# Altium schematic sheet RGB LEDs.SchDoc
size A4
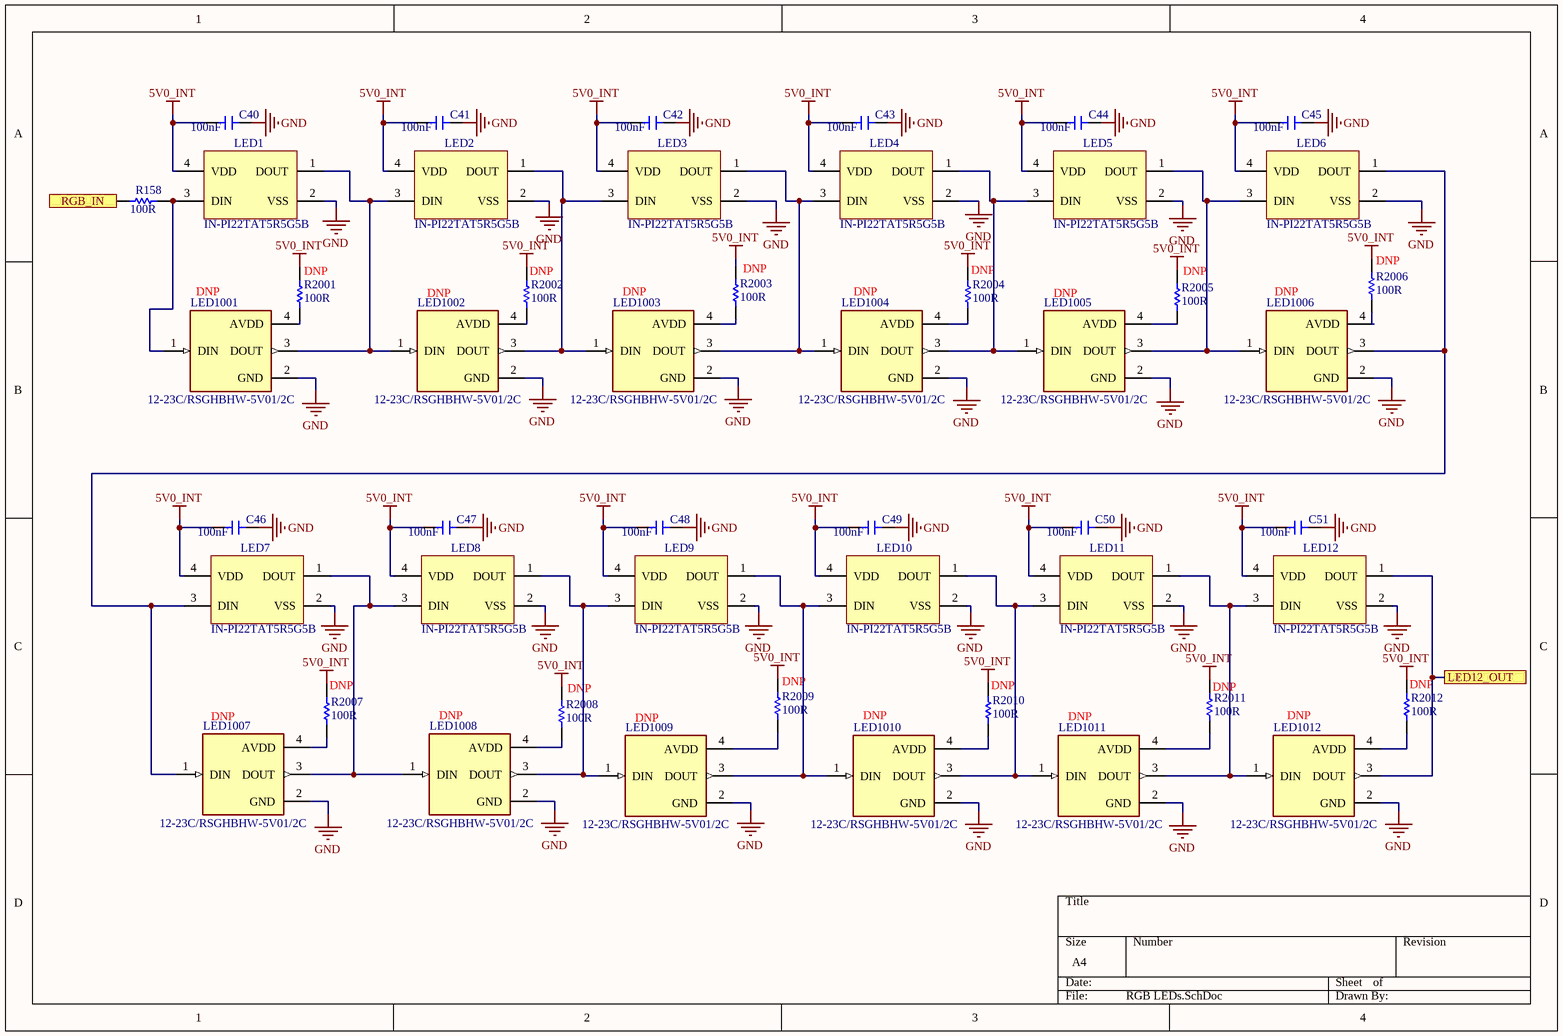
[diagram p0: RGB LEDs.SchDoc]

## Parts
C40  value 100nF  [CAP_0402_CER]  (hidden comment: CL05B104KP5NNNC)
C41  value 100nF  [CAP_0402_CER]  (hidden comment: CL05B104KP5NNNC)
C42  value 100nF  [CAP_0402_CER]  (hidden comment: CL05B104KP5NNNC)
C43  value 100nF  [CAP_0402_CER]  (hidden comment: CL05B104KP5NNNC)
C44  value 100nF  [CAP_0402_CER]  (hidden comment: CL05B104KP5NNNC)
C45  value 100nF  [CAP_0402_CER]  (hidden comment: CL05B104KP5NNNC)
C46  value 100nF  [CAP_0402_CER]  (hidden comment: CL05B104KP5NNNC)
C47  value 100nF  [CAP_0402_CER]  (hidden comment: CL05B104KP5NNNC)
C48  value 100nF  [CAP_0402_CER]  (hidden comment: CL05B104KP5NNNC)
C49  value 100nF  [CAP_0402_CER]  (hidden comment: CL05B104KP5NNNC)
C50  value 100nF  [CAP_0402_CER]  (hidden comment: CL05B104KP5NNNC)
C51  value 100nF  [CAP_0402_CER]  (hidden comment: CL05B104KP5NNNC)
LED1  IN-PI22TAT5R5G5B  [RGB_IN-PI22TAT5R5G5B]
LED2  IN-PI22TAT5R5G5B  [RGB_IN-PI22TAT5R5G5B]
LED3  IN-PI22TAT5R5G5B  [RGB_IN-PI22TAT5R5G5B]
LED4  IN-PI22TAT5R5G5B  [RGB_IN-PI22TAT5R5G5B]
LED5  IN-PI22TAT5R5G5B  [RGB_IN-PI22TAT5R5G5B]
LED6  IN-PI22TAT5R5G5B  [RGB_IN-PI22TAT5R5G5B]
LED7  IN-PI22TAT5R5G5B  [RGB_IN-PI22TAT5R5G5B]
LED8  IN-PI22TAT5R5G5B  [RGB_IN-PI22TAT5R5G5B]
LED9  IN-PI22TAT5R5G5B  [RGB_IN-PI22TAT5R5G5B]
LED10  IN-PI22TAT5R5G5B  [RGB_IN-PI22TAT5R5G5B]
LED11  IN-PI22TAT5R5G5B  [RGB_IN-PI22TAT5R5G5B]
LED12  IN-PI22TAT5R5G5B  [RGB_IN-PI22TAT5R5G5B]
LED1001  12-23C/RSGHBHW-5V01/2C  Place: DNP  [LED_12-23C/RSGHBHW-5V01/2C]  (no BOM)
LED1002  12-23C/RSGHBHW-5V01/2C  Place: DNP  [LED_12-23C/RSGHBHW-5V01/2C]  (no BOM)
LED1003  12-23C/RSGHBHW-5V01/2C  Place: DNP  [LED_12-23C/RSGHBHW-5V01/2C]  (no BOM)
LED1004  12-23C/RSGHBHW-5V01/2C  Place: DNP  [LED_12-23C/RSGHBHW-5V01/2C]  (no BOM)
LED1005  12-23C/RSGHBHW-5V01/2C  Place: DNP  [LED_12-23C/RSGHBHW-5V01/2C]  (no BOM)
LED1006  12-23C/RSGHBHW-5V01/2C  Place: DNP  [LED_12-23C/RSGHBHW-5V01/2C]  (no BOM)
LED1007  12-23C/RSGHBHW-5V01/2C  Place: DNP  [LED_12-23C/RSGHBHW-5V01/2C]  (no BOM)
LED1008  12-23C/RSGHBHW-5V01/2C  Place: DNP  [LED_12-23C/RSGHBHW-5V01/2C]  (no BOM)
LED1009  12-23C/RSGHBHW-5V01/2C  Place: DNP  [LED_12-23C/RSGHBHW-5V01/2C]  (no BOM)
LED1010  12-23C/RSGHBHW-5V01/2C  Place: DNP  [LED_12-23C/RSGHBHW-5V01/2C]  (no BOM)
LED1011  12-23C/RSGHBHW-5V01/2C  Place: DNP  [LED_12-23C/RSGHBHW-5V01/2C]  (no BOM)
LED1012  12-23C/RSGHBHW-5V01/2C  Place: DNP  [LED_12-23C/RSGHBHW-5V01/2C]  (no BOM)
R158  value 100R  [RES_0402_SMD]  (hidden comment: RMCF0402JT100R)
R2001  value 100R  Place: DNP  [RES_0402_SMD]  (hidden comment: RMCF0402JT100R)  (no BOM)
R2002  value 100R  Place: DNP  [RES_0402_SMD]  (hidden comment: RMCF0402JT100R)  (no BOM)
R2003  value 100R  Place: DNP  [RES_0402_SMD]  (hidden comment: RMCF0402JT100R)  (no BOM)
R2004  value 100R  Place: DNP  [RES_0402_SMD]  (hidden comment: RMCF0402JT100R)  (no BOM)
R2005  value 100R  Place: DNP  [RES_0402_SMD]  (hidden comment: RMCF0402JT100R)  (no BOM)
R2006  value 100R  Place: DNP  [RES_0402_SMD]  (hidden comment: RMCF0402JT100R)  (no BOM)
R2007  value 100R  Place: DNP  [RES_0402_SMD]  (hidden comment: RMCF0402JT100R)  (no BOM)
R2008  value 100R  Place: DNP  [RES_0402_SMD]  (hidden comment: RMCF0402JT100R)  (no BOM)
R2009  value 100R  Place: DNP  [RES_0402_SMD]  (hidden comment: RMCF0402JT100R)  (no BOM)
R2010  value 100R  Place: DNP  [RES_0402_SMD]  (hidden comment: RMCF0402JT100R)  (no BOM)
R2011  value 100R  Place: DNP  [RES_0402_SMD]  (hidden comment: RMCF0402JT100R)  (no BOM)
R2012  value 100R  Place: DNP  [RES_0402_SMD]  (hidden comment: RMCF0402JT100R)  (no BOM)

## Ports
LED12_OUT, RGB_IN

## Nets
5V0_INT: C40.2 C41.2 C42.2 C43.2 C44.2 C45.2 C46.2 C47.2 C48.2 C49.2 C50.2 C51.2 LED1.4(VDD) LED2.4(VDD) LED3.4(VDD) LED4.4(VDD) LED5.4(VDD) LED6.4(VDD) LED7.4(VDD) LED8.4(VDD) LED9.4(VDD) LED10.4(VDD) LED11.4(VDD) LED12.4(VDD) R2001.2 R2002.2 R2003.2 R2004.1 R2005.1 R2006.1 R2007.1 R2008.1 R2009.1 R2010.1 R2011.1 R2012.1
GND: C40.1 C41.1 C42.1 C43.1 C44.1 C45.1 C46.1 C47.1 C48.1 C49.1 C50.1 C51.1 LED1.2(VSS) LED2.2(VSS) LED3.2(VSS) LED4.2(VSS) LED5.2(VSS) LED6.2(VSS) LED7.2(VSS) LED8.2(VSS) LED9.2(VSS) LED10.2(VSS) LED11.2(VSS) LED12.2(VSS) LED1001.2(GND) LED1002.2(GND) LED1003.2(GND) LED1004.2(GND) LED1005.2(GND) LED1006.2(GND) LED1007.2(GND) LED1008.2(GND) LED1009.2(GND) LED1010.2(GND) LED1011.2(GND) LED1012.2(GND)
LED12_OUT: LED12.1(DOUT) LED1012.3(DOUT) ; port LED12_OUT
RGB_IN: R158.2 ; port RGB_IN
NetLED1_1: LED1.1(DOUT) LED2.3(DIN) LED1001.3(DOUT) LED1002.1(DIN)
NetLED1_3: LED1.3(DIN) LED1001.1(DIN) R158.1
NetLED2_1: LED2.1(DOUT) LED3.3(DIN) LED1002.3(DOUT) LED1003.1(DIN)
NetLED3_1: LED3.1(DOUT) LED4.3(DIN) LED1003.3(DOUT) LED1004.1(DIN)
NetLED4_1: LED4.1(DOUT) LED5.3(DIN) LED1004.3(DOUT) LED1005.1(DIN)
NetLED5_1: LED5.1(DOUT) LED6.3(DIN) LED1005.3(DOUT) LED1006.1(DIN)
NetLED6_1: LED6.1(DOUT) LED7.3(DIN) LED1006.3(DOUT) LED1007.1(DIN)
NetLED7_1: LED7.1(DOUT) LED8.3(DIN) LED1007.3(DOUT) LED1008.1(DIN)
NetLED8_1: LED8.1(DOUT) LED9.3(DIN) LED1008.3(DOUT) LED1009.1(DIN)
NetLED9_1: LED9.1(DOUT) LED10.3(DIN) LED1009.3(DOUT) LED1010.1(DIN)
NetLED10_1: LED10.1(DOUT) LED11.3(DIN) LED1010.3(DOUT) LED1011.1(DIN)
NetLED11_1: LED11.1(DOUT) LED12.3(DIN) LED1011.3(DOUT) LED1012.1(DIN)
NetLED1001_4: LED1001.4(AVDD) R2001.1
NetLED1002_4: LED1002.4(AVDD) R2002.1
NetLED1003_4: LED1003.4(AVDD) R2003.1
NetLED1004_4: LED1004.4(AVDD) R2004.2
NetLED1005_4: LED1005.4(AVDD) R2005.2
NetLED1006_4: LED1006.4(AVDD) R2006.2
NetLED1007_4: LED1007.4(AVDD) R2007.2
NetLED1008_4: LED1008.4(AVDD) R2008.2
NetLED1009_4: LED1009.4(AVDD) R2009.2
NetLED1010_4: LED1010.4(AVDD) R2010.2
NetLED1011_4: LED1011.4(AVDD) R2011.2
NetLED1012_4: LED1012.4(AVDD) R2012.2

## Library data of the parts
C40-C51 = CAP_GEN_CER: 100nF 0402 Ceramic Capacitor; Voltage: 10V; Place: POP; Part Number: CL05B104KP5NNNC; Power: *; Package: *; Tolerance: *; Operating Temp.: *
LED1-LED12 = IN-PI22TAT5R5G5B: ADDRESS LED DISCRETE SERIAL RGB; Manufacturer: Inolux; Place: P; Part Number: IN-PI22TAT5R5G5B; Operating Temp.: -40°C ~ 85°C; Power: N/A; Tolerance: N/A; Value: N/A; Voltage: N/A; Package: IN-PI22TAT5R5G5B
LED1001-LED1012 = 12-23C/RSGHBHW-5V01/2C: Addressable Lighting series 1 LED Discrete Serial (Shift Register) Red, Green, Blue (RGB) 3.00mm L x 1.00mm W; MF: Everlight Electronics Co Ltd; Package: SMD-4 Everlight Electronics Co Ltd; SnapEDA_Link: https://www.snapeda.com/parts/12-23C/RSGHBHW-5V01/2C/Everlight+Electronics+Co+Ltd/view-part/?ref=snap; MP: 12-23C/RSGHBHW-5V01/2C; Purchase-URL: https://pricing.snapeda.com/search/part/12-23C/RSGHBHW-5V01/2C/?ref=eda; Value: *; Availability: In Stock; Price: None; Check_prices: https://www.snapeda.com/parts/12-23C/RSGHBHW-5V01/2C/Everlight+Electronics+Co+Ltd/view-part/?ref=eda; Part Number: 12-23C/RSGHBHW-5V01/2C
R158 = RES_GEN_SMD: Generic Chip Res 100R; Tolerance: 5 %; Place: POP; Package: *; Part Number: RMCF0402JT100R; Power: *; Voltage: *; Operating Temp.: *
R2001-R2012 = RES_GEN_SMD: Generic Chip Res 100R; Tolerance: 5 %; Package: *; Part Number: RMCF0402JT100R; Power: *; Voltage: *; Operating Temp.: *